# Altium schematic sheet PLWD_LTE_modem.SchDoc: UG96_Modem
size A3; Date: Not used; ApprovedBy: Not used; CheckedBy: Not used; Author: Not used; CompanyName: STMicroelectronics; DrawnBy: Not used; Engineer: Not used; Organization: Not used; Address1: Not used; Address2: Not used; Address3: Not used; Address4: Not used; DocumentNumber: 1; Revision: Not used; SheetNumber: 6; SheetTotal: 11; CurrentTime: Not used; CurrentDate: Not used; Time: Not used; DocumentFullPathAndName: Not used; DocumentName: Not used; ModifiedDate: Not used; ImagePath: Not used; ProjectName: Not used; Application_BuildNumber: Not used
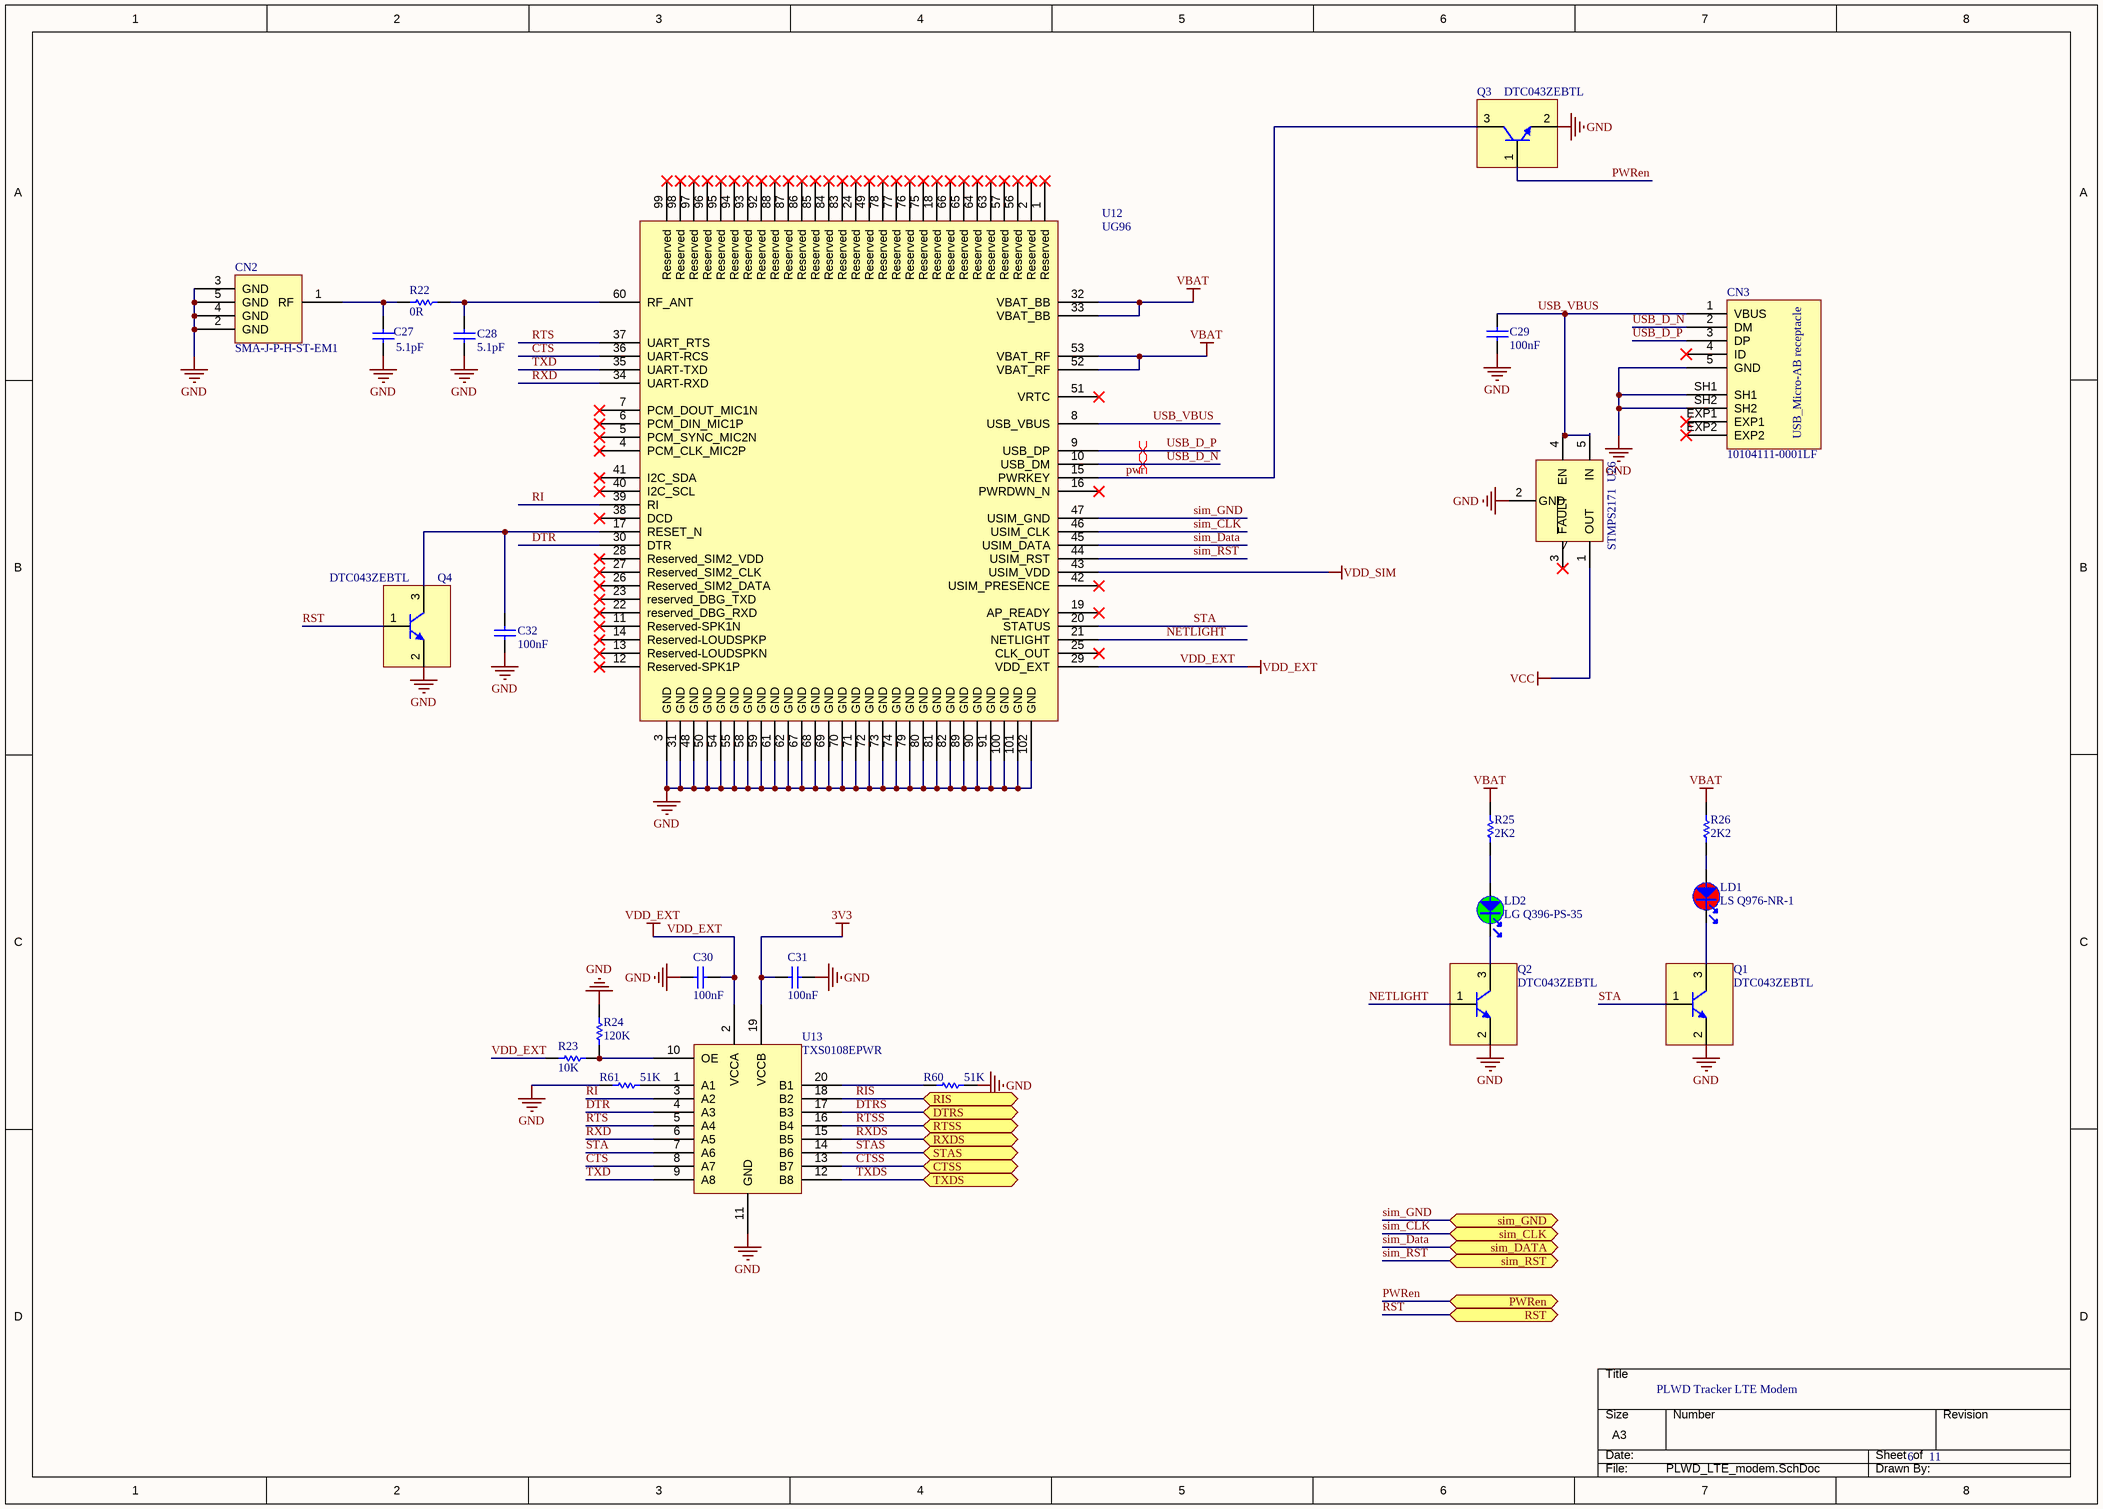
[diagram p0: PLWD_LTE_modem.SchDoc]

## Parts
C27  value 5.1pF  [C0402]  (hidden comment: Capacitor)
C28  value 5.1pF  [C0402]  (hidden comment: Capacitor)
C29  value 100nF  [C0402]  (hidden comment: Capacitor)
C30  value 100nF  [C0402]  (hidden comment: Capacitor)
C31  value 100nF  [C0402]  (hidden comment: Capacitor)
C32  value 100nF  [C0402]  (hidden comment: Capacitor)
CN2  SMA-J-P-H-ST-EM1  [CON_SAMTEC_SMA-J-P-X-ST-EM1]
CN3  value 10104111-0001LF  [CON_USBMICROAB_FCI_10104111-0001LF]  (hidden comment: USB_uAB_10104111-0001LF)
LD1  value LS Q976-NR-1  [LED_0603_RED]  (hidden comment: LED_red)
LD2  value LG Q396-PS-35  [LED_0603_GREEN]  (hidden comment: LED_green)
Q1  DTC043ZEBTL  [NPN_SOT416-FL_EMT3F_1616_SC89]
Q2  DTC043ZEBTL  [NPN_SOT416-FL_EMT3F_1616_SC89]
Q3  DTC043ZEBTL  [NPN_SOT416-FL_EMT3F_1616_SC89]
Q4  DTC043ZEBTL  [NPN_SOT416-FL_EMT3F_1616_SC89]
R22  value 0R  [R0402]  (hidden comment: Resistor)
R23  value 10K  [R0603]  (hidden comment: Resistor)
R24  value 120K  [R0402]  (hidden comment: Resistor)
R25  value 2K2  [R0402]  (hidden comment: Resistor)
R26  value 2K2  [R0402]  (hidden comment: Resistor)
R60  value 51K  [R0402]  (hidden comment: Resistor)
R61  value 51K  [R0402]  (hidden comment: Resistor)
U12  UG96  [MOD_2G-3G_QUECTEL_UG96-UG95-M95-R2-0_COMPATIBLE-DESIGN-V1-0]
U13  TXS0108EPWR  [ICC_TSSOP20_6P50X4P40_P065]
U26  value STMPS2171  [MOS_SOT23-5L]  (hidden comment: STMPS2171STR)

## Ports
CTSS (bidir), DTRS (bidir), PWRen (bidir), RIS (bidir), RST (bidir), RTSS (bidir), RXDS (bidir), sim_CLK (bidir), sim_DATA (bidir), sim_GND (bidir), sim_RST (bidir), STAS (bidir), TXDS (bidir)

## Nets
3V3: C31.1 U13.19(VCCB)
GND: C27.1 C28.1 C29.1 C30.1 C31.2 C32.1 CN2.2(GND) CN2.3(GND) CN2.4(GND) CN2.5(GND) CN3.5(GND) CN3.SH1 CN3.SH2 Q1.2(E) Q2.2(E) Q3.2(E) Q4.2(E) R24.2 R60.2 R61.1 U12.3(GND) U12.31(GND) U12.48(GND) U12.50(GND) U12.54(GND) U12.55(GND) U12.58(GND) U12.59(GND) U12.61(GND) U12.62(GND) U12.67(GND) U12.68(GND) U12.69(GND) U12.70(GND) U12.71(GND) U12.72(GND) U12.73(GND) U12.74(GND) U12.79(GND) U12.80(GND) U12.81(GND) U12.82(GND) U12.89(GND) U12.90(GND) U12.91(GND) U12.100(GND) U12.101(GND) U12.102(GND) U13.11(GND) U26.2(GND)
VBAT: R25.2 R26.2 U12.32(VBAT_BB) U12.33(VBAT_BB) U12.52(VBAT_RF) U12.53(VBAT_RF)
VCC: U26.1(OUT)
VDD_EXT: C30.2 R23.1 U12.29(VDD_EXT) U13.2(VCCA)
VDD_SIM: U12.43(USIM_VDD)
CTS: U12.36(UART-RCS) U13.8(A7)
CTSS: U13.13(B7) ; port CTSS
DTR: U12.30(DTR) U13.4(A3)
DTRS: U13.17(B3) ; port DTRS
NETLIGHT: Q2.1(B) U12.21(NETLIGHT)
pwr: Q3.3(C) U12.15(PWRKEY)
PWRen: Q3.1(B) ; port PWRen
RI: U12.39(RI) U13.3(A2)
RIS: U13.18(B2) ; port RIS
RST: Q4.1(B) ; port RST
RTS: U12.37(UART_RTS) U13.5(A4)
RTSS: U13.16(B4) ; port RTSS
RXD: U12.34(UART-RXD) U13.6(A5)
RXDS: U13.15(B5) ; port RXDS
sim_CLK: U12.46(USIM_CLK) ; port sim_CLK
sim_Data: U12.45(USIM_DATA) ; port sim_DATA
sim_GND: U12.47(USIM_GND) ; port sim_GND
sim_RST: U12.44(USIM_RST) ; port sim_RST
STA: Q1.1(B) U12.20(STATUS) U13.7(A6)
STAS: U13.14(B6) ; port STAS
TXD: U12.35(UART-TXD) U13.9(A8)
TXDS: U13.12(B8) ; port TXDS
USB_D_N: CN3.2(DM) U12.10(USB_DM)
USB_D_P: CN3.3(DP) U12.9(USB_DP)
USB_VBUS: C29.2 CN3.1(VBUS) U12.8(USB_VBUS) U26.4(EN) U26.5(IN)
NetC27_2: C27.2 CN2.1(RF) R22.1
NetC28_2: C28.2 R22.2 U12.60(RF_ANT)
NetC32_2: C32.2 Q4.3(C) U12.17(RESET_N)
NetLD1_1: LD1.1 R26.1
NetLD1_2: LD1.2 Q1.3(C)
NetLD2_1: LD2.1 R25.1
NetLD2_2: LD2.2 Q2.3(C)
NetR23_2: R23.2 R24.1 U13.10(OE)
NetR60_1: R60.1 U13.20(B1)
NetR61_2: R61.2 U13.1(A1)

Not connected (* = marked no-connect by the designer): CN3 4(ID)* EXP1* EXP2*; U12 1(Reserved)* 2(Reserved)* 4(PCM_CLK_MIC2P)* 5(PCM_SYNC_MIC2N)* 6(PCM_DIN_MIC1P)* 7(PCM_DOUT_MIC1N)* 11(Reserved-SPK1N)* 12(Reserved-SPK1P)* 13(Reserved-LOUDSPKN)* 14(Reserved-LOUDSPKP)* 16(PWRDWN_N)* 18(Reserved)* 19(AP_READY)* 22(reserved_DBG_RXD)* 23(reserved_DBG_TXD)* 24(Reserved)* 25(CLK_OUT)* 26(Reserved_SIM2_DATA)* 27(Reserved_SIM2_CLK)* 28(Reserved_SIM2_VDD)* 38(DCD)* 40(I2C_SCL)* 41(I2C_SDA)* 42(USIM_PRESENCE)* 49(Reserved)* 51(VRTC)* 56(Reserved)* 57(Reserved)* 63(Reserved)* 64(Reserved)* 65(Reserved)* 66(Reserved)* 75(Reserved)* 76(Reserved)* 77(Reserved)* 78(Reserved)* 83(Reserved)* 84(Reserved)* 85(Reserved)* 86(Reserved)* 87(Reserved)* 88(Reserved)* 92(Reserved)* 93(Reserved)* 94(Reserved)* 95(Reserved)* 96(Reserved)* 97(Reserved)* 98(Reserved)* 99(Reserved)*; U26 3(~{FAULT})*

## Layout directives
differential pair: USB_D_N, USB_D_P

## Notes on the sheet
- PLWD Tracker LTE Modem
- 6
- 11
- DWG NO:
- REV:
- THIS DOCUMENT AND THE DATA DISCLOSED HEREIN OR
- HEREWITH IS THE PROPERTY OF ALTIUM LIMITED AND MAY
- BE FREELY DISTRIBUTED IN WHOLE. NO RIGHTS ARE
- RESERVED OR EXPRESS OR IMPLIED WARANTEE GIVEN.
- REVISION
- DESCRIPTION
- DATE
- APPROVED
- ENG:
- APPROVALS
- PROJECT
- DSN:
- CHK:
- REFERENCE DOCUMENTS
- PROJECT REVISION:
- TITLE
- DOCUMENT REVISION:
- DESIGN ITEM:
- BOM:
- FAB DWG:
- PCB DWG:
- ASSY DWG:
- SCALE:
- A2
- SIZE
- CAGE CODE
- FILE NAME
- DWG NO.
- SHEET
- OF
- REV
- (in symbol MCD-01075) USB_Micro-AB receptacle

## Library data of the parts
C27 C28 = MCD-00003: Capacitor, 5.1pF, 50V, NPO, -+0.25pF, 0402, YAGEO; Manufacturer_Part_Number: CC0402CRNPO9BN5R1; Provided_By: Subcon; Internal_Part_Number: MCD-00003; PartType: Capacitors; ComponentLink1URL: Yageo_Capacitor_NP0_16V-to-50V.pdf; ECCN_US: n/a; ECCN_EU: n/a; Manufacturer: YAGEO; ComponentLink1Description: Yageo_Capacitor_NP0_16V-to-50V.pdf
C29-C32 = MCD-00006: Capacitor,100nF,16V,X7R,10%,0402,YAGEO; Manufacturer_Part_Number: CC0402KRX7R7BB104; Provided_By: Subcon; Internal_Part_Number: MCD-00006; PartType: Capacitors; ComponentLink1URL: Yageo_Capacitor_X7R-series.pdf; ECCN_US: n/a; ECCN_EU: n/a; Manufacturer: YAGEO; ComponentLink1Description: Yageo_Capacitor_X7R-series.pdf
CN2 = MCD-00279: RF SMA connector PCB edge; Manufacturer: SAMTEC; Provided_By: Subcon; Internal_Part_Number: MCD-00279; Value: SMA-J-P-H-ST-EM1; Status: check on going; PartType: Connectors; Manufacturer_Part_Number: SMA-J-P-H-ST-EM1; ComponentLink1Description: sma-j-p-x-st-em1-mkt.pdf
CN3 = MCD-01075: USB, micro AB receptacle,10104111-0001LF; Part_Type: Connector; Manufacturer: FCI; Provided_By: Subcon; Initial_Board_Reference: MB1329; Internal_Part_Number: MCD-01075; Status: Symbol available; Manufacturer_Part_Number: 10104111-0001LF; ComponentLink1Description: FCI_CONNECTOR_USB_uAB_10104111-0001LF; ComponentLink1URL: http://tunmcdsvn.tun.st.com/Component_Datasheet_Library/Trunk/Connectors/FCI_CONNECTOR_USB_uAB_10104111-0001LF; ECCN_US: n/a; ECCN_EU: n/a
LD1 = MCD-00332: red color LED; Manufacturer_Part_Number: Q65111A3964; Manufacturer: OSRAM; Provided_By: Subcon; Internal_Part_Number: MCD-00332; PartType: LED; ComponentLink1Description: LS Q976-NR-1.pdf
LD2 = MCD-00331: Green color LED; Manufacturer_Part_Number: Q65111A3964; Manufacturer: OSRAM; Provided_By: Subcon; Internal_Part_Number: MCD-00331; PartType: LED; ComponentLink1Description: LG Q396-PS-35.pdf
Q1-Q4 = MCD-00280: Buffer transistor; Manufacturer: Rohm; Provided_By: Subcon; Internal_Part_Number: MCD-00280; Value: DTC043ZEBTL; PartType: ICS; Manufacturer_Part_Number: DTC043ZEBTL; ComponentLink1Description: DTC043Z-series,pdf
R22 = MCD-00052: Resistor,0R,0402,5%,YAGEO; Manufacturer_Part_Number: RC0402JR-070RL; Provided_By: Subcon; Internal_Part_Number: MCD-00052; PartType: Resistors; ComponentLink1URL: Yageo_Resistor_RC0402-series.pdf; ECCN_US: n/a; ECCN_EU: n/a; Manufacturer: YAGEO; ComponentLink1Description: Yageo_Resistor_RC0402-series.pdf
R23 = MCD-00220: Resistor,10K,0603,1%,YAGEO; Manufacturer_Part_Number: RC0603FR-0710KL; Provided_By: Subcon; Internal_Part_Number: MCD-00220; PartType: Resistors; ComponentLink1URL: Yageo_Resistor_RC0603-series.pdf; ECCN_US: n/a; ECCN_EU: n/a; Manufacturer: YAGEO; ComponentLink1Description: Yageo_Resistor_RC0603-series.pdf
R24 = MCD-00166: Resistor,120K,0402,1%,YAGEO; Manufacturer_Part_Number: RC0402FR-07120KL; Provided_By: Subcon; Internal_Part_Number: MCD-00166; PartType: Resistors; ComponentLink1URL: Yageo_Resistor_RC0402-series.pdf; ECCN_US: n/a; ECCN_EU: n/a; Manufacturer: YAGEO; ComponentLink1Description: Yageo_Resistor_RC0402-series.pdf
R25 R26 = MCD-00057: Resistor,2K2,0402,1%,YAGEO; Manufacturer_Part_Number: RC0402FR-072K2L; Provided_By: Subcon; Internal_Part_Number: MCD-00057; PartType: Resistors; ComponentLink1URL: Yageo_Resistor_RC0402-series.pdf; ECCN_US: n/a; ECCN_EU: n/a; Manufacturer: YAGEO; ComponentLink1Description: Yageo_Resistor_RC0402-series.pdf
R60 R61 = MCD-00294: Resistor,51K,0402,1%,YAGEO; Manufacturer_Part_Number: RC0402FR-0751KL; Provided_By: Subcon; Internal_Part_Number: MCD-00294; PartType: Resistors; Manufacturer: YAGEO; ComponentLink1Description: Yageo_Resistor_RC0402-series.pdf; ComponentLink1URL: Yageo_Resistor_RC0402-series.pdf; ECCN_US: n/a; ECCN_EU: n/a
U12 = MCD-00290: cellular modem; Manufacturer: QUECTEL; Provided_By: Subcon; Internal_Part_Number: MCD-00290; Value: UG96; PartType: ICS; Manufacturer_Part_Number: UG96; ComponentLink1Description: UG96_95.pdf
U13 = MCD-00289: bidirectionnal level shifter; Manufacturer: TEXAS INSTRUMENTS; Provided_By: Subcon; Internal_Part_Number: MCD-00289; Value: TXS0108EPWR; PartType: ICS; Manufacturer_Part_Number: TXS0108EPWR; ComponentLink1Description: TXS0108EPWR.pdf
U26 = MCD-00622: IC, 1000mA Enhanced single channel power switches with active high enable pin, 90mR, SOT23-5L; Manufacturer: STMICROELECTRONICS; Provided_By: Subcon; Initial_Board_Reference: MB1264; Internal_Part_Number: MCD-00622; Status: Footprint available; Part_Type: IC; Manufacturer_Part_Number: STMPS2171STR; ComponentLink1Description: STM_PWR-Switch_STMPS2171STR.pdf; ComponentLink1URL: http://tunmcdsvn.tun.st.com/Component_Datasheet_Library/Trunk/IC/STM_PWR-Switch_STMPS2171STR